# Altium schematic sheet AD_PCB_EXTERNA.SchDoc
size A3; SheetNumber: 1; SheetTotal: 1
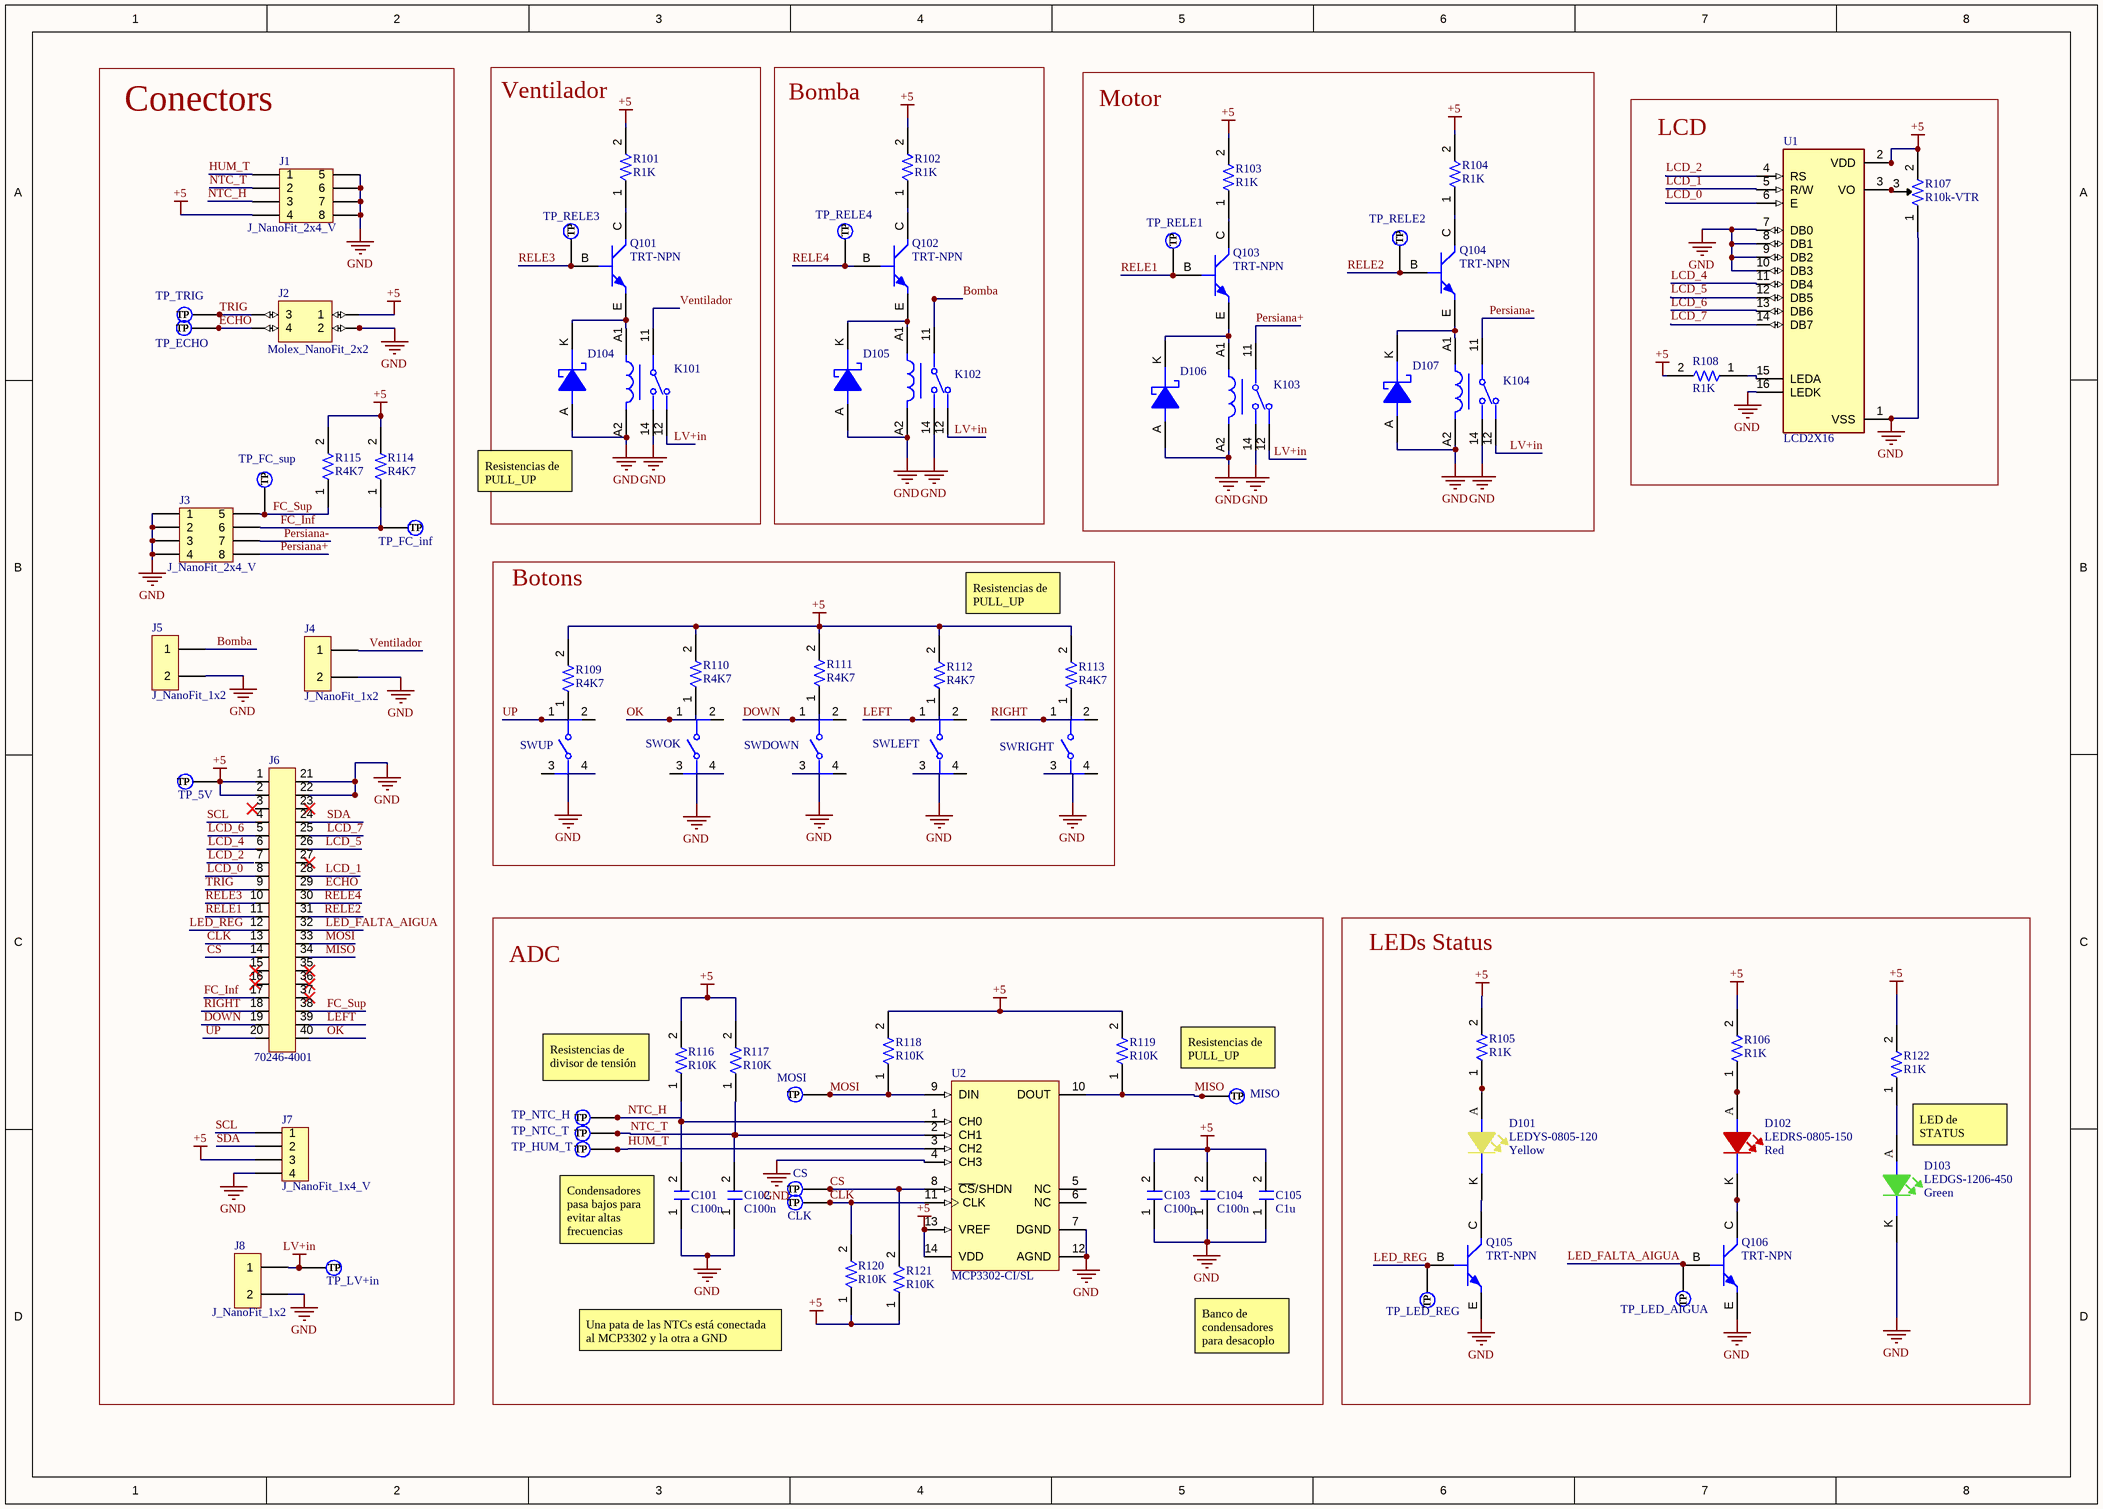
[diagram p0: AD_PCB_EXTERNA.SchDoc]

## Parts
C101  C100n  [C0805FNPC-R]
C102  C100n  [C0805FNPC-R]
C103  C100p  [C0805FNPC-W]
C104  C100n  [C0805FNPC-R]
C105  C1u  [C0805FNPC-R]
CLK  TestPoint  [TestPoint]  (value not drawn)  (no BOM)
CS  TestPoint  [TestPoint]  (value not drawn)  (no BOM)
D101  LEDYS-0805-120  Color: Yellow  [LED_0805_WE]
D102  LEDRS-0805-150  Color: Red  [LED_0805_WE]
D103  LEDGS-1206-450  Color: Green  [LED_1206_WE]
D104  DSC-0.5/30-SOD123  [DSC-SOD123]  (value not drawn)
D105  DSC-0.5/30-SOD123  [DSC-SOD123]  (value not drawn)
D106  DSC-0.5/30-SOD123  [DSC-SOD123]  (value not drawn)
D107  DSC-0.5/30-SOD123  [DSC-SOD123]  (value not drawn)
J1  J_NanoFit_2x4_V  [J_NanoFit_2x4_V]
J2  Molex_NanoFit_2x2  [J_NanoFit_2x2_V]
J3  J_NanoFit_2x4_V  [J_NanoFit_2x4_V]
J4  J_NanoFit_1x2  [FP-105309-1102-MFG]
J5  J_NanoFit_1x2  [FP-105309-1102-MFG]
J6  70246-4001  [CONN_7024640xx_MOL]
J7  J_NanoFit_1x4_V  [J_NanoFit_1x4_V]
J8  J_NanoFit_1x2  [FP-105309-1102-MFG]
K101  Relay_RZ01-1C4-D005  [FP-1415899-7-MFG]  (value not drawn)
K102  Relay_RZ01-1C4-D005  [FP-1415899-7-MFG]  (value not drawn)
K103  Relay_RZ01-1C4-D005  [FP-1415899-7-MFG]  (value not drawn)
K104  Relay_RZ01-1C4-D005  [FP-1415899-7-MFG]  (value not drawn)
MISO  TestPoint  [TestPoint]  (value not drawn)  (no BOM)
MOSI  TestPoint  [TestPoint]  (value not drawn)  (no BOM)
Q101  TRT-NPN  [TRT-NPN-0.5/45-SOT23]
Q102  TRT-NPN  [TRT-NPN-0.5/45-SOT23]
Q103  TRT-NPN  [TRT-NPN-0.5/45-SOT23]
Q104  TRT-NPN  [TRT-NPN-0.5/45-SOT23]
Q105  TRT-NPN  [TRT-NPN-0.5/45-SOT23]
Q106  TRT-NPN  [TRT-NPN-0.5/45-SOT23]
R101  R1K  [0805]
R102  R1K  [0805]
R103  R1K  [0805]
R104  R1K  [0805]
R105  R1K  [0805]
R106  R1K  [0805]
R107  R10k-VTR  [R10k-VTR]
R108  R1K  [0805]
R109  R4K7  [0805]
R110  R4K7  [0805]
R111  R4K7  [0805]
R112  R4K7  [0805]
R113  R4K7  [0805]
R114  R4K7  [0805]
R115  R4K7  [0805]
R116  R10K  [0805]
R117  R10K  [0805]
R118  R10K  [0805]
R119  R10K  [0805]
R120  R10K  [0805]
R121  R10K  [0805]
R122  R1K  [0805]
SWDOWN  tact_switch  [FP-PTS647SK38SMTR2LFS-MFG]  (value not drawn)
SWLEFT  tact_switch  [FP-PTS647SK38SMTR2LFS-MFG]  (value not drawn)
SWOK  tact_switch  [FP-PTS647SK38SMTR2LFS-MFG]  (value not drawn)
SWRIGHT  tact_switch  [FP-PTS647SK38SMTR2LFS-MFG]  (value not drawn)
SWUP  tact_switch  [FP-PTS647SK38SMTR2LFS-MFG]  (value not drawn)
TP_5V  TestPoint  [TestPoint]  (value not drawn)  (no BOM)
TP_ECHO  TestPoint  [TestPoint]  (value not drawn)  (no BOM)
TP_FC_inf  TestPoint  [TestPoint]  (value not drawn)  (no BOM)
TP_FC_sup  TestPoint  [TestPoint]  (value not drawn)  (no BOM)
TP_HUM_T  TestPoint  [TestPoint]  (value not drawn)  (no BOM)
TP_LED_AIGUA  TestPoint  [TestPoint]  (value not drawn)  (no BOM)
TP_LED_REG  TestPoint  [TestPoint]  (value not drawn)  (no BOM)
TP_LV+in  TestPoint  [TestPoint]  (value not drawn)  (no BOM)
TP_NTC_H  TestPoint  [TestPoint]  (value not drawn)  (no BOM)
TP_NTC_T  TestPoint  [TestPoint]  (value not drawn)  (no BOM)
TP_RELE1  TestPoint  [TestPoint]  (value not drawn)  (no BOM)
TP_RELE2  TestPoint  [TestPoint]  (value not drawn)  (no BOM)
TP_RELE3  TestPoint  [TestPoint]  (value not drawn)  (no BOM)
TP_RELE4  TestPoint  [TestPoint]  (value not drawn)  (no BOM)
TP_TRIG  TestPoint  [TestPoint]  (value not drawn)  (no BOM)
U1  LCD2X16  [LCD_LCD2X16]
U2  MCP3302-CI/SL  [SOIC-SL14_L]

## Blocks framed on the sheet
Conectors: J1-J8 R114 R115 TP_5V TP_ECHO TP_FC_inf TP_FC_sup TP_LV+in TP_TRIG
Ventilador: D104 K101 Q101 R101 TP_RELE3
Bomba: D105 K102 Q102 R102 TP_RELE4
Motor: D106 D107 K103 K104 Q103 Q104 R103 R104 TP_RELE1 TP_RELE2
LCD: R107 R108 U1
Botons: R109-R113 SWDOWN SWLEFT SWOK SWRIGHT SWUP
ADC: C101-C105 CLK CS MISO MOSI R116-R121 TP_HUM_T TP_NTC_H TP_NTC_T U2
LEDs Status: D101-D103 Q105 Q106 R105 R106 R122 TP_LED_AIGUA TP_LED_REG

## Nets
+5: C103.2 C104.2 C105.2 J1.4 J2.1 J6.1 J6.2 J7.3 R101.2 R102.2 R103.2 R104.2 R105.2 R106.2 R107.2 R108.2 R109.2 R110.2 R111.2 R112.2 R113.2 R114.2 R115.2 R116.2 R117.2 R118.2 R119.2 R120.1 R121.1 R122.2 TP_5V.1(TP) U1.2(VDD) U2.13(VREF) U2.14(VDD)
GND: C101.1 C102.1 C103.1 C104.1 C105.1 D103.K D104.A D105.A D106.A D107.A J1.5 J1.6 J1.7 J1.8 J2.2 J3.1 J3.2 J3.3 J3.4 J4.2 J5.2 J6.21 J6.22 J7.4 J8.2 K101.14 K101.A2 K102.14 K102.A2 K103.14 K103.A2 K104.14 K104.A2 Q105.E Q106.E R107.1 SWDOWN.3 SWLEFT.3 SWOK.4 SWRIGHT.3 SWUP.4 U1.1(VSS) U1.7(DB0) U1.8(DB1) U1.9(DB2) U1.10(DB3) U1.16(LEDK) U2.4(CH3) U2.7(DGND) U2.12(AGND)
LV+in: J8.1 K101.12 K102.12 K103.12 K104.12 TP_LV+in.1(TP)
Bomba: J5.1 K102.11
CLK: CLK.1(TP) J6.13 R120.2 U2.11(CLK)
CS: CS.1(TP) J6.14 R121.2 U2.8(~{CS}/SHDN)
DOWN: J6.19 R111.1 SWDOWN.1
ECHO: J2.4 J6.29 TP_ECHO.1(TP)
FC_Inf: J3.6 J6.17 R114.1 TP_FC_inf.1(TP)
FC_Sup: J3.5 J6.38 R115.1 TP_FC_sup.1(TP)
HUM_T: J1.1 TP_HUM_T.1(TP) U2.3(CH2)
LCD_0: J6.8 U1.6(E)
LCD_1: J6.28 U1.5(R/W)
LCD_2: U1.4(RS)
LCD_4: J6.6 U1.11(DB4)
LCD_5: J6.26 U1.12(DB5)
LCD_6: J6.5 U1.13(DB6)
LCD_7: J6.25 U1.14(DB7)
LED_FALTA_AIGUA: J6.32 Q106.B TP_LED_AIGUA.1(TP)
LED_REG: J6.12 Q105.B TP_LED_REG.1(TP)
LEFT: J6.39 R112.1 SWLEFT.1
MISO: J6.34 MISO.1(TP) R119.1 U2.10(DOUT)
MOSI: J6.33 MOSI.1(TP) R118.1 U2.9(DIN)
NTC_H: C101.2 J1.3 R116.1 TP_NTC_H.1(TP) U2.1(CH0)
NTC_T: C102.2 J1.2 R117.1 TP_NTC_T.1(TP) U2.2(CH1)
OK: J6.40 R110.1 SWOK.1
Persiana+: J3.8 K103.11
Persiana-: J3.7 K104.11
RELE1: J6.11 Q103.B TP_RELE1.1(TP)
RELE2: J6.31 Q104.B TP_RELE2.1(TP)
RELE3: J6.10 Q101.B TP_RELE3.1(TP)
RELE4: J6.30 Q102.B TP_RELE4.1(TP)
RIGHT: J6.18 R113.1 SWRIGHT.1
SCL: J6.4 J7.1
SDA: J6.24 J7.2
TRIG: J2.3 J6.9 TP_TRIG.1(TP)
UP: J6.20 R109.1 SWUP.1
Ventilador: J4.1 K101.11
NetD101_A: D101.A R105.1
NetD101_K: D101.K Q105.C
NetD102_A: D102.A R106.1
NetD102_K: D102.K Q106.C
NetD103_A: D103.A R122.1
NetD104_K: D104.K K101.A1 Q101.E
NetD105_K: D105.K K102.A1 Q102.E
NetD106_K: D106.K K103.A1 Q103.E
NetD107_K: D107.K K104.A1 Q104.E
NetQ101_C: Q101.C R101.1
NetQ102_C: Q102.C R102.1
NetQ103_C: Q103.C R103.1
NetQ104_C: Q104.C R104.1
NetR107_3: R107.3 U1.3(VO)
NetR108_1: R108.1 U1.15(LEDA)

Not connected (* = marked no-connect by the designer): J6 3 7 15* 16* 23* 27* 35* 36* 37*; SWDOWN 2 4; SWLEFT 2 4; SWOK 2 3; SWRIGHT 2 4; SWUP 2 3; U2 5(NC) 6(NC)

## Notes on the sheet
- Resistencias de PULL_UP
- Resistencias de divisor de tensión
- (near MISO) Resistencias de PULL_UP
- LED de STATUS
- Condensadores pasa bajos para evitar altas frecuencias
- Una pata de las NTCs está conectada al MCP3302 y la otra a GND
- Banco de condensadores para desacoplo
- THIS DOCUMENT AND THE DATA DISCLOSED HEREIN OR
- HEREWITH IS THE PROPERTY OF ALTIUM LIMITED AND MAY
- DWG NO:
- REVISION
- REV:
- DESCRIPTION
- DATE
- APPROVED
- BE FREELY DISTRIBUTED IN WHOLE. NO RIGHTS ARE
- RESERVED OR EXPRESS OR IMPLIED WARANTEE GIVEN.
- ENG:
- APPROVALS
- PROJECT
- DSN:
- CHK:
- REFERENCE DOCUMENTS
- PROJECT REVISION:
- TITLE
- DOCUMENT REVISION:
- DESIGN ITEM:
- BOM:
- FAB DWG:
- PCB DWG:
- ASSY DWG:
- SCALE:
- A3
- SIZE
- CAGE CODE
- FILE NAME
- DWG NO.
- SHEET
- OF
- REV

## Library data of the parts
C101 C102 C104 = CMP-00063-3: Cap, 0.1ΜF, 50V, 10%, X7R, 0805; Manufacturer Part Number 1: 885012207098; Manufacturer 1: Wurth Electronics; Value: 100nF; .Creator: DR; ComponentLink2Description: http://www.farnell.com/datasheets/1958498.pdf?src-supplier=Element14; ComponentLink1Description: http://www.farnell.com/datasheets/1958498.pdf?src-supplier=Farnell; Thickness: 0.035inch; ComponentLink1URL: http://www.farnell.com/datasheets/1958498.pdf?src-supplier=Farnell; Min Operating Temperature: -55°C; Packaging: Cut Tape; ComponentLink2URL: http://www.farnell.com/datasheets/1958498.pdf?src-supplier=Element14; Mount: Surface Mount; Voltage Rating (DC): 50V; Tolerance: 10%; Category: Ceramic Capacitors; RoHS: Yes; Width: 0.049inch; Pricing 1: 100=0,10200, 500=0,07100, 2000=0,06100 (GBP); RoHS Compliant: Yes; ComponentLink4Description: http://www.farnell.com/datasheets/1958498.pdf?src-supplier=Newark; Dielectric: X7R; Stock 1: 8000; Length: 0.079inch; ComponentLink3URL: https://katalog.we-online.de/pbs/datasheet/885012207098.pdf?src-supplier=Digi-Key; ComponentLink3Description: https://katalog.we-online.de/pbs/datasheet/885012207098.pdf?src-supplier=Digi-Key; Design Item ID: C100n-50V-0805FNPC-X7R; ComponentLink4URL: http://www.farnell.com/datasheets/1958498.pdf?src-supplier=Newark; REACH SVHC: Unknown; Case Code (Metric): 2012; Voltage Rating: 50V; Max Operating Temperature: 125°C; Source: Passives.SchLib; Case/Package: 0805
C103 = CMP-00068-3: Multilayer Ceramic Capacitor, Wcap-Csgp Series, 100 Pf, 5%, C0G / Np0, 50 V, 0805 [2012 Metric] Rohs Compliant: Yes; Manufacturer: Wurth Electronics; Manufacturer Part Number: 885012007057; Voltage Rating: 50V; .Creator: DR; Value: 100pF; Source: Passives.SchLib; ComponentLink2URL: https://katalog.we-online.de/pbs/datasheet/885012007057.pdf?src-supplier=Digi-Key; Tolerance: 5%; ComponentLink3Description: http://www.farnell.com/datasheets/1958443.pdf?src-supplier=Element14; ComponentLink5Description: Where buy it; ComponentLink2Description: https://katalog.we-online.de/pbs/datasheet/885012007057.pdf?src-supplier=Digi-Key; Length: 0.079inch; Voltage Rating (DC): 50V; ComponentLink4Description: http://www.farnell.com/datasheets/1958443.pdf?src-supplier=Newark; Packaging: Cut Tape; Stock 1: 1; Thickness: 0.035inch; ComponentLink4URL: http://www.farnell.com/datasheets/1958443.pdf?src-supplier=Newark; RoHS Compliant: Yes; ComponentLink1URL: http://www.farnell.com/datasheets/1958443.pdf?src-supplier=Farnell; Case/Package: 0805; REACH SVHC: Unknown; RoHS: Yes; Mount: Surface Mount; Design Item ID: C100p-50V-0805FNPC-C0G/NP0; ComponentLink1Description: http://www.farnell.com/datasheets/1958443.pdf?src-supplier=Farnell; Dielectric: C0G; Min Operating Temperature: -55°C; ComponentLink3URL: http://www.farnell.com/datasheets/1958443.pdf?src-supplier=Element14; Case Code (Metric): 2012; Pricing 1: 4000=0,03900, 12000=0,03800 (USD); Max Operating Temperature: 125°C; Width: 0.049inch; ComponentLink5URL: https://www.we-online.com/catalog/en/WCAP-CSGP-50VDC#885012007057; Category: Ceramic Capacitors
C105 = CMP-00052-2: Multilayer Ceramic Capacitor, Wcap-Csgp Series, 1 F, 10%, X7R, 50 V, 0805 [2012 Metric] Rohs Compliant: Yes; Manufacturer 1: Wurth Electronics; Manufacturer Part Number 1: 885012207103; Voltage Rating: 50V; Value: 1µF; .Creator: GP; ComponentLink3URL: https://katalog.we-online.de/pbs/datasheet/885012107003.pdf?src-supplier=Digi-Key; Thickness: 0.053inch; ComponentLink2URL: http://www.farnell.com/datasheets/1958501.pdf?src-supplier=Element14; Width: 0.049inch; ComponentLink3Description: https://katalog.we-online.de/pbs/datasheet/885012107003.pdf?src-supplier=Digi-Key; Case Code (Metric): 2012; Packaging: Cut Tape; Stock 1: 5100; Min Operating Temperature: -55°C; ComponentLink4Description: http://www.farnell.com/datasheets/1958501.pdf?src-supplier=Newark; Length: 0.079inch; Voltage Rating (DC): 50V; Max Operating Temperature: 85°C; Case/Package: 0805; Design Item ID: C1u-50V-0805FNPC-X7R; Pricing 1: 50=0,27200, 250=0,25300, 500=0,22800, 1250=0,20100, 2500=0,17100 (GBP); Source: Passives.SchLib; Mount: Surface Mount; Tolerance: 10%; Category: Ceramic Capacitors; ComponentLink1Description: http://www.farnell.com/datasheets/1958501.pdf?src-supplier=Farnell; ComponentLink1URL: http://www.farnell.com/datasheets/1958501.pdf?src-supplier=Farnell; RoHS Compliant: Yes; REACH SVHC: Unknown; ComponentLink4URL: http://www.farnell.com/datasheets/1958501.pdf?src-supplier=Newark; ComponentLink2Description: http://www.farnell.com/datasheets/1958501.pdf?src-supplier=Element14; Dielectric: X7R; RoHS: Yes
CLK CS MISO MOSI TP_5V TP_ECHO TP_FC_inf TP_FC_sup TP_HUM_T TP_LED_AIGUA TP_LED_REG TP_LV+in TP_NTC_H TP_NTC_T TP_RELE1-TP_RELE4 TP_TRIG = CMP-00042-2: Test Point 1x1 mm; .PCBcheck: GP; Source: e-Tech_Racing.SchLib; Design Item ID: TestPoint; .Creator: GP; Category: TestPoint; .SCHcheck: GP
D101 = CMP-00136-1: 2 V Yellow LED 2012 (0805) SMD, Wurth Elektronik WL-SMCW 150080YS75000; Manufacturer 1: Wurth Electronics; Luminous Intensity: 120mcd; Forward Current: 30mA; Forward Voltage: 2V; Dominant Wavelength: 590nm; Test Current: 20mA; .Creator: DR; Viewing Angle: 140°; Lens Style: Clear,Rectangular; Length: 2mm; REACH SVHC: Unknown; ComponentLink7Description: https://datasheet.ciiva.com/29563/150080ys75000-29563020.pdf?src-supplier=Digi-Key; ComponentLink1Description: Datasheet; ComponentLink2Description: Where buy it; ComponentLink2URL: https://katalog.we-online.de/en/led/WL-SMCW/150080YS75000; Min Operating Temperature: -40°C; Stock 1: 2100; Case/Package: 0805; ComponentLink6URL: https://datasheet.ciiva.com/29563/150080ys75000-29563019.pdf?src-supplier=Digi-Key; ComponentLink3Description: https://datasheet.ciiva.com/23843/150080ys75000-23843256.pdf?src-supplier=Newark; Mount: Surface Mount; ComponentLink5URL: https://datasheet.ciiva.com/22656/1911353-22656971.pdf?src-supplier=Element14; ComponentLink3URL: https://datasheet.ciiva.com/23843/150080ys75000-23843256.pdf?src-supplier=Newark; Manufacturer Part Number 1: 150080YS75000; Case Code (Metric): 2012; Design Item ID: LEDYS-0805-120; ComponentLink1URL: https://www.we-online.com/catalog/datasheet/150080YS75000.pdf; ComponentLink6Description: https://datasheet.ciiva.com/29563/150080ys75000-29563019.pdf?src-supplier=Digi-Key; Case Code (Imperial): 0805; ComponentLink7URL: https://datasheet.ciiva.com/29563/150080ys75000-29563020.pdf?src-supplier=Digi-Key; Category: LEDs; Package Quantity: 4000; Source: Semiconductor.SchLib; ComponentLink5Description: https://datasheet.ciiva.com/22656/1911353-22656971.pdf?src-supplier=Element14; Height: 0.7mm; Wavelength: 590nm; ComponentLink8Description: https://datasheet.ciiva.com/29563/150080ys75000-29563021.pdf?src-supplier=Digi-Key; Pricing 1: 50=0,19300, 500=0,12900, 750=0,12300, 1500=0,11700, 3000=0,11100 (USD); ComponentLink8URL: https://datasheet.ciiva.com/29563/150080ys75000-29563021.pdf?src-supplier=Digi-Key; RoHS: Yes; Width: 1.25mm; ComponentLink4Description: https://datasheet.ciiva.com/29279/759438-da-01-en-chipled-0805-w-kl-gelb-150080ys75000-29279034.pdf?src-supplier=Conrad; Max Operating Temperature: 85°C; RoHS Compliant: Yes; ComponentLink4URL: https://datasheet.ciiva.com/29279/759438-da-01-en-chipled-0805-w-kl-gelb-150080ys75000-29279034.pdf?src-supplier=Conrad; Packaging: Tape and Reel
D102 = CMP-00133-1: 0805(H=0.8mm) 红色 高亮 λD=625nm VF=2V IF=30mA PD=72mW; Manufacturer 1: Wurth Electronics; Manufacturer Part Number 1: 150080RS75000; Forward Current: 30mA; Viewing Angle: 140°; .Creator: DR; Forward Voltage: 2V; Dominant Wavelength: 625nm; Luminous Intensity: 150mcd; Test Current: 20mA; Lens Style: Clear,Rectangular; ComponentLink4URL: https://datasheet.ciiva.com/29279/759435-da-01-en-chipled-0805-w-kl-rot-150080rs75000-29279032.pdf?src-supplier=Conrad; ComponentLink2Description: Where buy it; Case/Package: 0805; Category: LEDs; ComponentLink3URL: https://datasheet.ciiva.com/22656/150080rs75000-22656961.pdf?src-supplier=Element14; Height: 0.7mm; Case Code (Metric): 2012; Min Operating Temperature: -40°C; ComponentLink3Description: https://datasheet.ciiva.com/22656/150080rs75000-22656961.pdf?src-supplier=Element14; Stock 1: 1; Width: 1.25mm; RoHS Compliant: Yes; Max Operating Temperature: 85°C; Design Item ID: LEDRS-0805-150; ComponentLink2URL: https://katalog.we-online.de/en/led/WL-SMCW/150080RS75000; Packaging: Tape and Reel; ComponentLink1Description: Datasheet; Wavelength: 625nm; Case Code (Imperial): 0805; RoHS: Yes; Source: Semiconductor.SchLib; ComponentLink4Description: https://datasheet.ciiva.com/29279/759435-da-01-en-chipled-0805-w-kl-rot-150080rs75000-29279032.pdf?src-supplier=Conrad; REACH SVHC: Unknown; Pricing 1: 50=0,19300, 500=0,12900, 1000=0,12300, 2000=0,11700, 4000=0,11100 (USD); Package Quantity: 4000; Length: 2mm; Mount: Surface Mount; ComponentLink1URL: https://www.we-online.com/catalog/datasheet/150080RS75000.pdf
D103 = CMP-00132-1: Led, Green, 520 Nm, 3.2 V, 30 Ma, 450 Mcd Rohs Compliant: Yes; Manufacturer: Wurth Electronics; Manufacturer Part Number: 150120GS75000; .Creator: GP; Viewing Angle: 140°; Wavelength: 520nm; Test Current: 20mA; Luminous Intensity: 450mcd; Forward Voltage: 3.2V; Lens Style: Clear,Rectangular; Forward Current: 30mA; ComponentLink6Description: https://datasheet.ciiva.com/29561/150120gs75000-29561885.pdf?src-supplier=Digi-Key; REACH SVHC: Unknown; ComponentLink3Description: https://datasheet.ciiva.com/48430/150120gs75000-eng-tds-48430053.pdf?src-supplier=Distrelec; ComponentLink7Description: Where buy it; ComponentLink4Description: https://datasheet.ciiva.com/29561/150120gs75000-29561883.pdf?src-supplier=Digi-Key; ComponentLink1URL: https://datasheet.ciiva.com/22656/150120gs75000-22656979.pdf?src-supplier=Element14; Case Code (Imperial): 1206; ComponentLink4URL: https://datasheet.ciiva.com/29561/150120gs75000-29561883.pdf?src-supplier=Digi-Key; ComponentLink7URL: https://www.we-online.com/catalog/en/WL-SMCW?sq=150120GS75000#150120GS75000; Packaging: Tape and Reel; RoHS Compliant: Yes; ComponentLink5URL: https://datasheet.ciiva.com/29561/150120gs75000-29561884.pdf?src-supplier=Digi-Key; Stock 1: 1; Width: 1.6mm; Design Item ID: LEDGS-1206-450; Height: 0.68mm; Case/Package: 1206; Category: LEDs; ComponentLink1Description: https://datasheet.ciiva.com/22656/150120gs75000-22656979.pdf?src-supplier=Element14; Dominant Wavelength: 520nm; Source: Semiconductor.SchLib; Package Quantity: 3000; Max Operating Temperature: 85°C; Pricing 1: 50=0,23200, 500=0,16400, 750=0,15500, 1500=0,15000, 3000=0,14200 (USD); ComponentLink3URL: https://datasheet.ciiva.com/48430/150120gs75000-eng-tds-48430053.pdf?src-supplier=Distrelec; Case Code (Metric): 3216; Length: 3.2mm; Mount: Surface Mount; RoHS: Yes; ComponentLink2URL: https://datasheet.ciiva.com/29279/759441-da-01-en-chipled-1206-w-kl-gruen-150120gs75000-29279042.pdf?src-supplier=Conrad; ComponentLink5Description: https://datasheet.ciiva.com/29561/150120gs75000-29561884.pdf?src-supplier=Digi-Key; Min Operating Temperature: -40°C; ComponentLink2Description: https://datasheet.ciiva.com/29279/759441-da-01-en-chipled-1206-w-kl-gruen-150120gs75000-29279042.pdf?src-supplier=Conrad; ComponentLink6URL: https://datasheet.ciiva.com/29561/150120gs75000-29561885.pdf?src-supplier=Digi-Key
D104-D107 = CMP-00165-2: VR=30V IF=500mA 30pF P=410mW; Peak Non-Repetitive Surge Current: 5.5A; .Creator: GP; Voltage Rating (DC): 30V; Current Rating: 500mA; Max Reverse Leakage Current: 130uA; Element Configuration: Single; Polarity: Standard; Forward Voltage: 430mV; ComponentLink5Description: https://datasheet.ciiva.com/910/mbr0530-910516.pdf?src-supplier=Digi-Key; ComponentLink2Description: Where buy it; ComponentLink1Description: Datasheet; Pricing 1: 1=0,34400, 10=0,23900, 100=0,12200, 500=0,10000 (USD); ComponentLink7Description: https://datasheet.ciiva.com/8300/mbr0530-8300905.pdf?src-supplier=Avnet; ComponentLink3URL: https://datasheet.ciiva.com/30479/0900766b810e2512-30479401.pdf?src-supplier=RSComponents; Stock 1: 9; Max Reverse Voltage (DC): 30V; Max Repetitive Reverse Voltage (Vrrm): 30V; Width: 1.6mm; ComponentLink6URL: https://datasheet.ciiva.com/25931/mbr0530-25931989.pdf?src-supplier=Avnet+Europe; Contact Plating: Tin,Matte; Height: 1.03mm; Category: Diode; ComponentLink1URL: *; Max Surge Current: 5.5A; ComponentLink4URL: https://datasheet.ciiva.com/34301/974753-34301826.pdf?src-supplier=Jameco; ComponentLink4Description: https://datasheet.ciiva.com/34301/974753-34301826.pdf?src-supplier=Jameco; ComponentLink5URL: https://datasheet.ciiva.com/910/mbr0530-910516.pdf?src-supplier=Digi-Key; Length: 2.7mm; ComponentLink10URL: https://datasheet.ciiva.com/910/mbr0530-910518.pdf?src-supplier=Digi-Key; ComponentLink2URL: *; ComponentLink7URL: https://datasheet.ciiva.com/8300/mbr0530-8300905.pdf?src-supplier=Avnet; Max Forward Surge Current (Ifsm): 5.5A; Design Item ID: DSC-0.5/30-SOD123; REACH SVHC: No SVHC; Package Quantity: 1; RoHS Compliant: Yes; Lead Free: Lead Free; Max Reverse Current: 130uA; ComponentLink8Description: https://datasheet.ciiva.com/17318/mbr0530-17318568.pdf?src-supplier=Future+Electronics; Series: -; Average Rectified Current: 500mA; Source: Filter components.SchLib; Output Current: 500mA; ComponentLink9URL: https://datasheet.ciiva.com/15144/getdatasheetpartid-86760-15144598.pdf?src-supplier=Verical; Weight: 0.03g; ComponentLink6Description: https://datasheet.ciiva.com/25931/mbr0530-25931989.pdf?src-supplier=Avnet+Europe; ComponentLink9Description: https://datasheet.ciiva.com/15144/getdatasheetpartid-86760-15144598.pdf?src-supplier=Verical; Mount: Surface Mount; ComponentLink3Description: https://datasheet.ciiva.com/30479/0900766b810e2512-30479401.pdf?src-supplier=RSComponents; Forward Current: 500mA; Radiation Hardening: No; ComponentLink8URL: https://datasheet.ciiva.com/17318/mbr0530-17318568.pdf?src-supplier=Future+Electronics; ComponentLink10Description: https://datasheet.ciiva.com/910/mbr0530-910518.pdf?src-supplier=Digi-Key
J1 J3 = CMP-00019-1: Nano-Fit Conn Power HDR 8 POS 2.5mm Solder ST Thru-Hole 8 Terminal 1 Port Nano-Fit™ Frame; Manufacturer: Molex; Manufacturer part number: 105310-1108; ComponentLink4Description: Where buy it; ComponentLink4URL: https://www.molex.com/molex/products/part-detail/pcb_headers/1053101108; ComponentLink3URL: http://www.farnell.com/datasheets/2551089.pdf?src-supplier=Newark; RoHS: No; Pricing 1: 8=1,52500, 40=0,87900, 80=0,83600 (GBP); ComponentLink3Description: http://www.farnell.com/datasheets/2551089.pdf?src-supplier=Newark; ComponentLink2Description: https://www.molex.com/pdm_docs/ps/PS-105300-100-001.pdf?src-supplier=Digi-Key; Stock 1: 1512; ComponentLink2URL: https://www.molex.com/pdm_docs/ps/PS-105300-100-001.pdf?src-supplier=Digi-Key; ComponentLink1URL: https://www.molex.com/pdm_docs/sd/1053101108_sd.pdf; Design Item ID: J_NanoFit_2x4_V; ComponentLink1Description: Datasheet; Source: Electromechanical.SchLib; Category: Headers and Wire Housings
J2 = CMP-00005-3: Nano-Fit Vertical Header Through Hole 2.50mm Pitch Dual Row 4 Circuits Tin (Sn) Plating Black; Manufacturer: Molex; Manufacturer part number: 1053141104; Maximum voltage: 750 V AC; Connections: 2x2; Temperature rating: -40° to +105°C; Category type: PCB header; Maximum current: 7.5 A; .Creator: GP; Product name: Nano-Fit; ComponentLink2URL: *; ComponentLink1Description: Datasheet; Source: Electromechanical.SchLib; ComponentLink1URL: https://www.molex.com/molex/products/part-detail/pcb_headers/1053141104; Category: Connector; ComponentLink2Description: Where buy it; Stock 1: 3160; Pricing 1: 1=1,25000, 10=1,03600, 300=0,86330, 1200=0,69065, 5100=0,60432, 10200=0,57410 (USD); Design Item ID: J_Supply; RoHS: *; ComponentLink3URL: http://www.farnell.com/datasheets/2551094.pdf?src-supplier=Farnell; Orientation: Right Angle; Mount: Through hole; ComponentLink4Description: http://www.farnell.com/datasheets/2551094.pdf?src-supplier=Newark; Flammability: 94V-0; Application: Wire to board; ComponentLink4URL: http://www.farnell.com/datasheets/2551094.pdf?src-supplier=Newark; ComponentLink3Description: http://www.farnell.com/datasheets/2551094.pdf?src-supplier=Farnell
J4 J5 J8 = CMP-002-00001-2: Conn HDR 2 POS 2.5mm Solder ST Thru-Hole 2 Terminal 1 Port Nano-Fit Tray
J6 = CMP-002-00559-1: Board Connector, 40 Contact(s), 2 Row(s), Male, Straight, 0.1 inch Pitch, Solder Terminal, Guide Slot, Black Insulator, Receptacle; Mounting Technology: Board; Max Operating Temperature: 120°C; RoHS Compliant: Yes; Connector Type: BOARD CONNECTOR; Min Operating Temperature: -55°C
J7 = CMP-00018-1: Nano-Fit Vertical Header Through Hole 2.50mm Pitch Single Row 4 Circuits with Kinked Pins 0.38; Manufacturer 1: Molex; Manufacturer Part Number 1: 105309-1204; .Creator: DO; Pricing 1: 1=1,37050, 10=1,11700, 100=0,95270, 500=0,86980, 1000=0,74060, 2500=0,71930, 5000=0,68450, 10000=0,66860 (USD); ComponentLink2URL: http://www.farnell.com/datasheets/2221349.pdf?src-supplier=Newark; ComponentLink2Description: http://www.farnell.com/datasheets/2221349.pdf?src-supplier=Newark; ComponentLink4URL: http://www.farnell.com/datasheets/2059602.pdf?src-supplier=Element14; ComponentLink3Description: http://www.literature.molex.com/SQLImages/kelmscott/Molex/PDF_Images/987651-1223.PDF?src-supplier=Digi-Key; ComponentLink1URL: http://farnell.com//datasheets/2221349.pdf?src-supplier=Farnell; Source: Electromechanical.SchLib; ComponentLink3URL: http://www.literature.molex.com/SQLImages/kelmscott/Molex/PDF_Images/987651-1223.PDF?src-supplier=Digi-Key; Category: Headers and Wire Housings; Design Item ID: J_NanoFit_1x4_V; ComponentLink4Description: http://www.farnell.com/datasheets/2059602.pdf?src-supplier=Element14; ComponentLink1Description: http://farnell.com//datasheets/2221349.pdf?src-supplier=Farnell; Stock 1: 709; RoHS: No
K101-K104 = CMP-00028-00000-1: Power/Signal Relay, SPDT, Momentary, 0.084A (Coil), 5VDC (Coil), 420mW (Coil), DC Input, AC Output, Through Hole-Straight Mount. 1415899-7. RZ01-1C4-D005; RoHS Compliant: Yes; Mounting Technology: Through Hole; Max Operating Temperature: 85°C; Min Operating Temperature: -40°C
Q101-Q106 = CMP-00148-1: ON Semi BC817-25LT1G NPN Bipolar Transistor; 0.5 A; 45 V; 3-Pin SOT-23; Current Rating: 500mA; Collector-emitter Voltage-Max: 700mV; Gain Bandwidth Product: 100MHz; Element Configuration: Single; hFE Min: 160; Collector Emitter Voltage (VCEO): 45V; Emitter Base Voltage (VEBO): 5V; Collector Base Voltage (VCBO): 50V; Power Dissipation: 300mW; .Creator: GP; Number of Elements: 1; ComponentLink2URL: *; Packaging: *; ComponentLink14Description: https://datasheet.ciiva.com/976/bc817-16lt1-d-976357.pdf?src-supplier=Digi-Key; Radiation Hardening: No; Pricing 1: 1=0,20000, 10=0,18500, 100=0,10080, 500=0,06204, 1000=0,04229 (USD); ComponentLink9URL: https://datasheet.ciiva.com/4722/bc817-16lt1-d-104560-4722229.pdf?src-supplier=Mouser; Vce max: *; Gain: *; Max Power Dissipation: *; ComponentLink5URL: https://datasheet.ciiva.com/1196/bc817-16lt1-d-1196558.pdf?src-supplier=Element14; ComponentLink16URL: https://datasheet.ciiva.com/976/bc817-16lt1-d-976356.pdf?src-supplier=Digi-Key; Contact Plating: Tin,Matte; Max Operating Temperature: *; Package: *; Width: 1.3mm; ComponentLink2Description: Where buy it; ComponentLink15URL: https://datasheet.ciiva.com/976/bc817-16lt1-d-976358.pdf?src-supplier=Digi-Key; Package Quantity: 1; RoHS: *; Collector Emitter Saturation Voltage: 700mV; Transition Frequency: 100MHz; ComponentLink7URL: https://datasheet.ciiva.com/22664/bc817-16lt1-d-22664204.pdf?src-supplier=Element14; ComponentLink10URL: https://datasheet.ciiva.com/1195/bc817-16lt1-d-1195763.pdf?src-supplier=Element14; Design Item ID: TRT-NPN-0.5/45-SOT23; Series: -; ComponentLink8URL: https://datasheet.ciiva.com/22664/1842041-22664101.pdf?src-supplier=Element14; Lead Free: Lead Free; ComponentLink4Description: https://datasheet.ciiva.com/15138/getdatasheetpartid-38405-15138602.pdf?src-supplier=Verical; ComponentLink12Description: https://datasheet.ciiva.com/11197/bc817-16lt1-d-11197514.pdf?src-supplier=Avnet; ComponentLink11Description: https://datasheet.ciiva.com/1195/bc817-16lt1-d-1195764.pdf?src-supplier=Element14; Max Frequency: 100MHz; ComponentLink13URL: https://datasheet.ciiva.com/25996/bc817-16lt1-d-25996327.pdf?src-supplier=Avnet+Europe; Max Breakdown Voltage: 45V; Polarity: *; ComponentLink6URL: https://datasheet.ciiva.com/22641/bc817-16lt1-d-22641013.pdf?src-supplier=Farnell; ComponentLink4URL: https://datasheet.ciiva.com/15138/getdatasheetpartid-38405-15138602.pdf?src-supplier=Verical; Height: 0.94mm; Power rating: *; Source: Semiconductor.SchLib; Max Collector Current: 500mA; ComponentLink15Description: https://datasheet.ciiva.com/976/bc817-16lt1-d-976358.pdf?src-supplier=Digi-Key; ComponentLink11URL: https://datasheet.ciiva.com/1195/bc817-16lt1-d-1195764.pdf?src-supplier=Element14; REACH SVHC: No SVHC; Number of Pins: 3; Manufacturer Part Number: *; Case/Package: SOT-23-3; ComponentLink1Description: Datasheet; RoHS Compliant: Yes; Collector Emitter Breakdown Voltage: 45V; Halogen Free: Halogen Free; Frequency: 100MHz; ComponentLink3Description: https://datasheet.ciiva.com/27748/2010413-27748829.pdf?src-supplier=Jameco; ComponentLink3URL: https://datasheet.ciiva.com/27748/2010413-27748829.pdf?src-supplier=Jameco; ComponentLink9Description: https://datasheet.ciiva.com/4722/bc817-16lt1-d-104560-4722229.pdf?src-supplier=Mouser; Category: Transistor; Type: *; ComponentLink8Description: https://datasheet.ciiva.com/22664/1842041-22664101.pdf?src-supplier=Element14; ComponentLink10Description: https://datasheet.ciiva.com/1195/bc817-16lt1-d-1195763.pdf?src-supplier=Element14; ComponentLink1URL: *; ComponentLink16Description: https://datasheet.ciiva.com/976/bc817-16lt1-d-976356.pdf?src-supplier=Digi-Key; Manufacturer: *; ComponentLink12URL: https://datasheet.ciiva.com/11197/bc817-16lt1-d-11197514.pdf?src-supplier=Avnet; ComponentLink6Description: https://datasheet.ciiva.com/22641/bc817-16lt1-d-22641013.pdf?src-supplier=Farnell; ComponentLink13Description: https://datasheet.ciiva.com/25996/bc817-16lt1-d-25996327.pdf?src-supplier=Avnet+Europe; Ic max: *; ComponentLink14URL: https://datasheet.ciiva.com/976/bc817-16lt1-d-976357.pdf?src-supplier=Digi-Key; Length: 2.9mm; ComponentLink5Description: https://datasheet.ciiva.com/1196/bc817-16lt1-d-1196558.pdf?src-supplier=Element14; Min Operating Temperature: *; ComponentLink7Description: https://datasheet.ciiva.com/22664/bc817-16lt1-d-22664204.pdf?src-supplier=Element14
R101-R106 R108-R122 = CMP-009-00019-6: Fixed Resistor, Thin Film, 0.125W, 1000ohm, 150V, 0.1% +/-Tol, 15ppm/Cel, Surface Mount, 0805; Value: 1k; Power: 125mW; Tolerance: 0.1%; Max Operating Temperature: 125°C; Mounting Technology: Surface Mount; Case/Package: 0805; Pins: 2; Min Operating Temperature: -55°C; RoHS Compliant: Yes
R107 = CMP-00072-1: Trimmer, Cermet, Rest 10 Kilohms, PCB, 25 Turns, Pwr-Rtg 0.5W, 3296 Series; Manufacturer Part Number: 3296W-1-103LF; Manufacturer: Bourns; Insulation Resistance: 1GR; Max Power Dissipation: 500mW; .Creator: DO; Tolerance: 10%; Value: 10k; Number of Turns: 25; Temperature Coefficient: 100ppm/°C; ComponentLink6Description: https://datasheet.ciiva.com/18411/70153578-18411561.pdf?src-supplier=Allied+Electronics; ComponentLink3URL: https://datasheet.ciiva.com/29122/447277-da-01-en-trimmer-tht3296w-1-103lf-10k-0-5w-29122362.pdf?src-supplier=Conrad; Contact Plating: Tin,Matte; ComponentLink5URL: https://datasheet.ciiva.com/1131/1815117-1131273.pdf?src-supplier=Element14; ComponentLink2Description: https://datasheet.ciiva.com/11830/0900766b8069ccf4-11830871.pdf?src-supplier=RSComponents; Depth: 4.83mm; Power Rating: 500mW; Series: 3296; ComponentLink5Description: https://datasheet.ciiva.com/1131/1815117-1131273.pdf?src-supplier=Element14; Category: Variable Resistors and Potentiometers; ComponentLink1URL: https://datasheet.ciiva.com/19454/853572-19454866.pdf?src-supplier=Jameco; ComponentLink9URL: https://datasheet.ciiva.com/2156/3296-2156893.pdf?src-supplier=Digi-Key; RoHS Compliant: Yes; Weight: 0.03oz; ComponentLink3Description: https://datasheet.ciiva.com/29122/447277-da-01-en-trimmer-tht3296w-1-103lf-10k-0-5w-29122362.pdf?src-supplier=Conrad; Source: Passives.SchLib; Mount: PCB,Through Hole; ComponentLink8Description: https://datasheet.ciiva.com/30093/3296-30093899.pdf?src-supplier=Onlinecomponents.com; ComponentLink2URL: https://datasheet.ciiva.com/11830/0900766b8069ccf4-11830871.pdf?src-supplier=RSComponents; ComponentLink8URL: https://datasheet.ciiva.com/30093/3296-30093899.pdf?src-supplier=Onlinecomponents.com; Design Item ID: R10k-VTR; Military Standard: Not; Radiation Hardening: No; Length: 9.53mm; Resistance Tolerance: 10%; ComponentLink11URL: https://es.rs-online.com/web/p/potenciometros-de-ajuste/5219647; Packaging: Rail/Tube; Min Operating Temperature: -55°C; Color: Blue; Stock 1: 3300; ComponentLink11Description: Where buy it; RoHS: Yes; ComponentLink4Description: https://datasheet.ciiva.com/26913/3296w-1-103lf-26913885.pdf?src-supplier=IIIC; ComponentLink10Description: https://datasheet.ciiva.com/14173/ew3296-dat-e-14173022.pdf?src-supplier=Distrelec; Resistor Type: Cermet; REACH SVHC: No SVHC; Max Operating Temperature: 125°C; Height: 0.395inch; Lead Free: Lead Free; ComponentLink7Description: https://datasheet.ciiva.com/3266/3296-3266187.pdf?src-supplier=Avnet; ComponentLink9Description: https://datasheet.ciiva.com/2156/3296-2156893.pdf?src-supplier=Digi-Key; Pricing 1: 50=2,54800, 100=2,31900, 200=2,14000, 300=1,88400, 500=1,55300 (USD); ComponentLink7URL: https://datasheet.ciiva.com/3266/3296-3266187.pdf?src-supplier=Avnet; Technology: CERMET; ComponentLink6URL: https://datasheet.ciiva.com/18411/70153578-18411561.pdf?src-supplier=Allied+Electronics; Termination: Pin; Width: 9.53mm; ComponentLink1Description: https://datasheet.ciiva.com/19454/853572-19454866.pdf?src-supplier=Jameco; ComponentLink10URL: https://datasheet.ciiva.com/14173/ew3296-dat-e-14173022.pdf?src-supplier=Distrelec; Taper: Linear; Package Quantity: 50; ComponentLink4URL: https://datasheet.ciiva.com/26913/3296w-1-103lf-26913885.pdf?src-supplier=IIIC
SWDOWN SWLEFT SWOK SWRIGHT SWUP = CMP-00028-00009-1: Keypad Switch, 1 Switches, SPST, Momentary-tactile, 0.05A, 12VDC, 2.94N, Solder Terminal, Surface Mount-straight; RoHS Compliant: Yes
U1 = CMP-179-000000-1: Display; Display: LCD 2x16 characters (blue backlight); MF: mikroElektronika; SnapEDA_Link: https://www.snapeda.com/parts/LCD%202X16/mikroElektronika/view-part/?ref=snap; Design Item ID: LCD2X16; Check_prices: https://www.snapeda.com/parts/LCD%202X16/mikroElektronika/view-part/?ref=eda; Component Type: Standard; Pin Count: 16; Source: LCD2X16.SchLib; Value: *; Package: TQFP-64 mikroElektronika; MP: LCD 2X16
U2 = CMP-031-00009-1: ADC, Successive Approximation, 13-Bit, 1 Func, 4 Channel, Serial Access, PDSO14; RoHS Compliant: Yes; Case/Package: SOP; Max Operating Temperature: 85°C; Min Operating Temperature: -40°C; Pins: 14